# Altium project project.PrjPCB
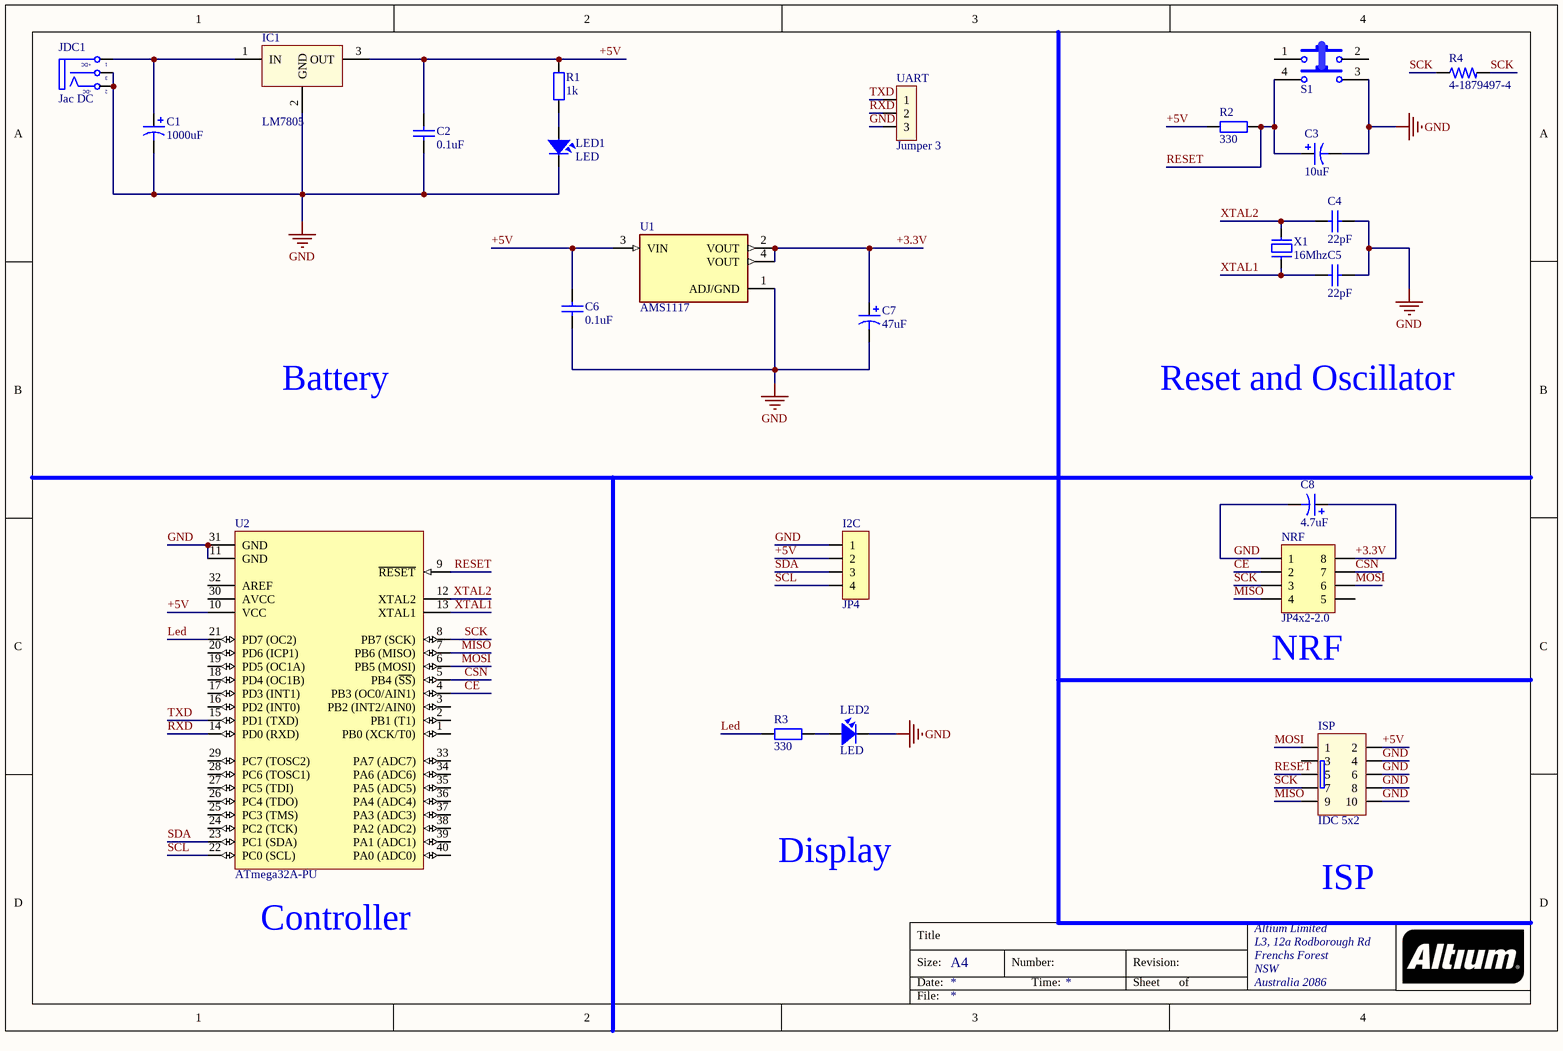
[diagram p0: project.SchDoc]
1 sheet, 24 parts. Net scope: global (net labels, ports and power ports of the same name join across sheets).
Board files: PCB1.PcbDoc, PCB2.PcbDoc

## Sheet project.SchDoc
size A4; Organization: Altium Limited; Address1: L3, 12a Rodborough Rd; Address2: Frenchs Forest; Address3: NSW; Address4: Australia 2086

### Parts
C1  1000uF  [C10mm]
C2  0.1uF  [C1206]
C3  10uF  [C10mm]
C4  22pF  [C1206]
C5  22pF  [C1206]
C6  0.1uF  [C1206]
C7  47uF  [C10mm]
C8  4.7uF  [C10mm]
I2C  JP4  [JP4-C1T]
IC1  LM7805  [QTO-220]
ISP  IDC 5x2  [IDC10]
JDC1  Jac DC  [DC-IN]
LED1  LED  [LED-3]
LED2  LED  [LED-3]
NRF  JP4x2-2.0  [J4-C2T]
R1  1k  [R1/4W]
R2  330  [R1/4W]
R3  330  [R1/4W]
R4  4-1879497-4  [RESC3115X65N]
S1  SW-4P-S  [SW-4P-S]  (value not drawn)
U1  AMS1117  [SOT229P700X180-4N]
U2  ATmega32A-PU  [DIP40/W0.6]
UART  Jumper 3  [JP3]
X1  16Mhz  [XT2]

### Nets
GND: C1.2 C2.1 C3.2 C4.1 C5.2 C6.1 C7.2 C8.2 I2C.1 IC1.2(GND) ISP.4 ISP.6 ISP.8 ISP.10 JDC1.2(TN) JDC1.3(S) LED1.2 LED2.2 NRF.1 S1.3 U1.1(ADJ/GND) U2.11(GND) U2.31(GND) UART.3
+3.3V: C7.1 C8.1 NRF.8 U1.2(VOUT) U1.4(VOUT)
+5V: C2.2 C6.2 I2C.2 IC1.3(OUT) ISP.2 R1.1 R2.2 U1.3(VIN) U2.10(VCC)
CE: NRF.2 U2.4(PB3_(OC0/AIN1))
CSN: NRF.7 U2.5(PB4_(~{SS}))
Led: R3.1 U2.21(PD7_(OC2))
MISO: ISP.9 NRF.4 U2.7(PB6_(MISO))
MOSI: ISP.1 NRF.6 U2.6(PB5_(MOSI))
RESET: C3.1 ISP.5 R2.1 S1.4 U2.9(~{RESET})
RXD: U2.14(PD0_(RXD)) UART.2
SCK: ISP.7 NRF.3 R4.1 R4.2 U2.8(PB7_(SCK))
SCL: I2C.4 U2.22(PC0_(SCL))
SDA: I2C.3 U2.23(PC1_(SDA))
TXD: U2.15(PD1_(TXD)) UART.1
XTAL1: C5.1 U2.13(XTAL1) X1.1
XTAL2: C4.2 U2.12(XTAL2) X1.2
NetC1_1: C1.1 IC1.1(IN) JDC1.1(T)
NetLED1_1: LED1.1 R1.2
NetLED2_1: LED2.1 R3.2

Not connected (* = marked no-connect by the designer): ISP 3; NRF 5; S1 1 2; U2 1(PB0_(XCK/T0)) 2(PB1_(T1)) 3(PB2_(INT2/AIN0)) 16(PD2_(INT0)) 17(PD3_(INT1)) 18(PD4_(OC1B)) 19(PD5_(OC1A)) 20(PD6_(ICP1)) 24(PC2_(TCK)) 25(PC3_(TMS)) 26(PC4_(TDO)) 27(PC5_(TDI)) 28(PC6_(TOSC1)) 29(PC7_(TOSC2)) 30(AVCC) 32(AREF) 33(PA7_(ADC7)) 34(PA6_(ADC6)) 35(PA5_(ADC5)) 36(PA4_(ADC4)) 37(PA3_(ADC3)) 38(PA2_(ADC2)) 39(PA1_(ADC1)) 40(PA0_(ADC0))

### Notes on the sheet
- Battery
- Reset and Oscillator
- (near NRF) NRF
- Display
- ISP
- (near U2) Controller
- Title
- Size:
- Date:
- A4
- Number:
- Time:
- Revision:
- Sheet
- of
- File:
- (in symbol DCIN) +DC; -DC

### Library data of the parts
C1 C3 C7 C8 = Cap Pol 8mm: Polarized Capacitor (Axial); Published: 8-Jun-2000; LatestRevisionDate: 17-Jul-2002; LatestRevisionNote: Re-released for DXP Platform.; PackageReference: POLAR0.8; Publisher: Altium Limited
C2 C4-C6 = Cap SMD 1206
I2C = JP4: WR-PHD 2.54 mm Angled Socket Header; Manufacturer: W¨¹rth Elektronik eiSos GmbH; partNo: 613004143121; ComponentLink1 Description: Manufacturer; ComponentLink2 Description: Datasheet; NoPins: 04; Created Date: 29 March 2013; ComponentLink1URL: http://www.we-online.com; ComponentLink2URL: http://katalog.we-online.de/em/datasheet/6130xx143121.pdf; Created by: Karrer Zheng
IC1 = LM78xx: On ap +, from + 5 to + 24VDC; Value: LM7805
ISP = IDC 5X2: Value: Header 5x2
JDC1 = DCIN: Jac DC input; Value: Jac DC
LED1 LED2 = LED: LED Single colour Green and Red; Value: LED 3 ly Single Colour
NRF = JP4x2-2.0: WR-PHD 2.00 mm Dual Pin Header; Manufacturer: W¨¹rth Elektronik eiSos GmbH; partNo: 62000821121; ComponentLink1 Description: Manufacturer; ComponentLink2 Description: Datasheet; NoPins: 08; Created Date: 2 April 2013; ComponentLink1URL: http://www.we-online.com; ComponentLink2URL: http://katalog.we-online.de/em/datasheet/6200xx21121.pdf; Created by: Karrer Zheng
R1-R3 = R1/4W: Resistor 1/4W; Value: R1/4W - 1K
R4 = 4-1879497-4: CRGH1206 5% 62R 0.5W; Package: None; Price: None; Value: *; MP: 4-1879497-4; Availability: Unavailable
S1 = SW-4PIN-SMALL: Switch Small 4 Pin; Published: 24-Mar-1999; LatestRevisionDate: 17-Jul-2002; LatestRevisionNote: Re-released for DXP Platform.; PackageReference: SPST-2; Publisher: Altium Limited
U1 = AMS1117: UNO PLUS Arduino R3 Shield, Xbee Arduino IDE Wheeled Robotics Kit; MF: Seeed Technology; Availability: Unavailable; SnapEDA_Link: https://www.snapeda.com/parts/AMS1117/Seeed%20Technology%20Co.%2C%20Ltd/view-part/184428/?ref=snap; MP: AMS1117; Price: None; Value: *; Package: SOT-223 Seeed Technology
U2 = ATmega32A-PU: 8-Bit AVR Microcontroller with 32K Bytes of In-System Programmable Flash Memory; Published: 17-Sep-2003; DatasheetVersion: 2503C-AVR-10/02; PackageVersion: revB, Sep-2001; PackageReference: 40P6; Publisher: Altium Limited; PackageDescription: 40-lead (0.600"/15.24mm Wide) Plastic Dual Inline Package (PDIP); Supplier 1: Digi-Key; Supplier Part Number 1: ATMEGA32-16PC-ND; Supplier 2: Mouser; Supplier Part Number 2: 556-ATMEGA32-16PC; Code_JEDEC: MS-011-AC; ComponentLink1Description: Datasheet; ComponentLink1URL: http://www.atmel.com/dyn/resources/prod_documents/doc2503.pdf; ComponentLink2Description: Atmel.com Home; ComponentLink2URL: http://www.atmel.com
UART = JP3: Value: J3
X1 = XT2: Crystal For all Crystal 2pin.; Value: 4Mhz